# Altium schematic sheet BE2022L-V10.SchDoc
size A4
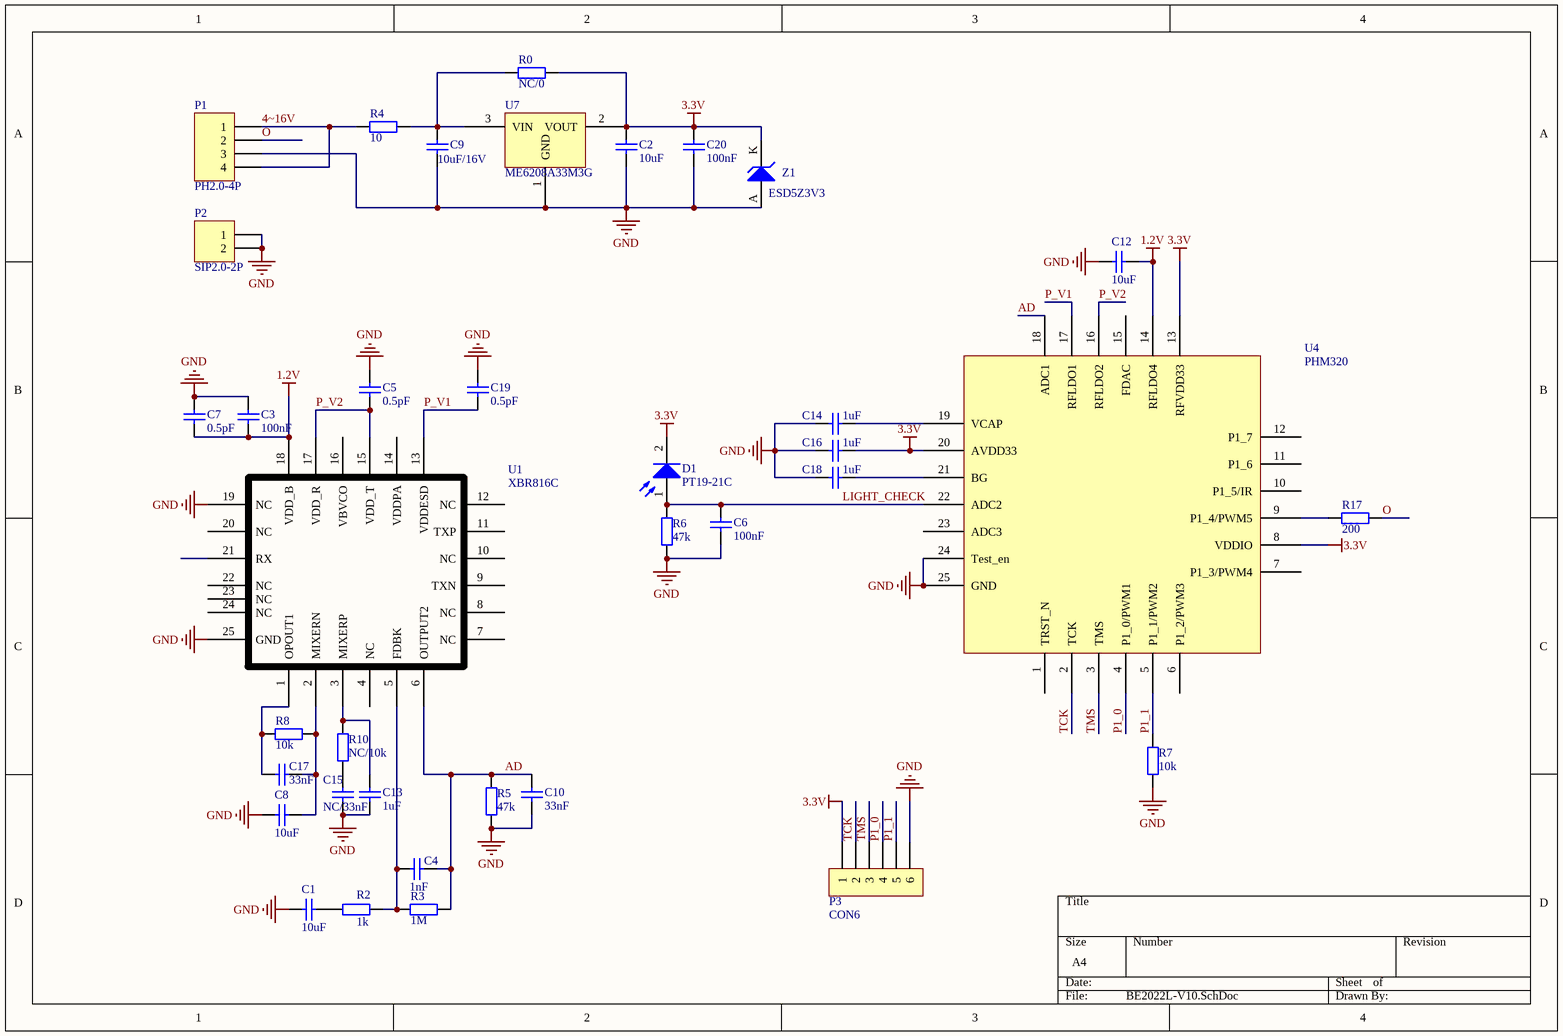
[diagram p0: BE2022L-V10.SchDoc]

## Parts
C1  10uF  [C0402]
C2  10uF  [C0402]
C3  100nF  [C0402]
C4  1nF  [C0402]
C5  0.5pF  [C0402]
C6  100nF  [C0402]
C7  0.5pF  [C0402]
C8  10uF  [C0402]
C9  10uF/16V  [C0603]
C10  33nF  [C0402]
C12  10uF  [C0402]
C13  1uF  [C0402]
C14  1uF  [C0402]
C15  NC/33nF  [C0402]
C16  1uF  [C0402]
C17  33nF  [C0402]
C18  1uF  [C0402]
C19  0.5pF  [C0402]
C20  100nF  [C0402]
D1  PT19-21C  [LED-0603]
P1  PH2.0-4P  [PH2.0-4P]
P2  SIP2.0-2P  [SIP2.0-2P]
P3  CON6  [CON 6PIN-1-2.0-DIP-P]
R0  NC/0  [R0402]
R2  1k  [R0402]
R3  1M  [R0402]
R4  10  [R0402]
R5  47k  [R0402]
R6  47k  [R0402]
R7  10k  [R0402]
R8  10k  [R0402]
R10  NC/10k  [R0402]
R17  200  [R0402]
U1  XBR816C  [QFN24-1]
U4  PHM320  [QFN24]
U7  ME6208A33M3G  [SOT-23-L]
Z1  ESD5Z3V3  [SOD-523]

## Nets
1.2V: C3.2 C7.1 C12.1 U1.18(VDD_B) U4.14(RFLDO4)
3.3V: C2.1 C16.1 C20.2 D1.2(K) P3.1 R0.2 U4.8(VDDIO) U4.13(RFVDD33) U4.20(AVDD33) U7.2(VOUT) Z1.K
GND: C1.2 C2.2 C3.1 C5.2 C6.2 C7.2 C8.1 C9.2 C10.2 C12.2 C13.1 C14.2 C15.1 C16.2 C18.2 C19.2 C20.1 P1.3 P2.1 P2.2 P3.6 R5.2 R6.2 R7.2 U1.19(NC) U1.25(GND) U4.24(Test_en) U4.25(GND) U7.1(GND) Z1.A
4~16V: P1.1 P1.4 R4.1
AD: C4.1 C10.1 R3.1 R5.1 U1.6(OUTPUT2) U4.18(ADC1)
LIGHT_CHECK: C6.1 D1.1(A) R6.1 U4.22(ADC2)
O: P1.2 R17.2
P1_0: P3.4 U4.4(P1_0/PWM1)
P1_1: P3.5 R7.1 U4.5(P1_1/PWM2)
P_V1: C19.1 U1.13(VDDESD) U4.17(RFLDO1)
P_V2: C5.1 U1.15(VDD_T) U1.17(VDD_R) U4.16(RFLDO2)
TCK: P3.2 U4.2(TCK)
TMS: P3.3 U4.3(TMS)
NetC1_1: C1.1 R2.1
NetC4_2: C4.2 R2.2 R3.2 U1.5(FDBK)
NetC8_2: C8.2 C17.1 R8.1 U1.2(MIXERN)
NetC9_1: C9.1 R0.1 R4.2 U7.3(VIN)
NetC13_2: C13.2 R10.1 U1.3(MIXERP)
NetC14_1: C14.1 U4.19(VCAP)
NetC15_2: C15.2 R10.2
NetC17_2: C17.2 R8.2 U1.1(OPOUT1)
NetC18_1: C18.1 U4.21(BG)
NetR17_1: R17.1 U4.9(P1_4/PWM5)

Not connected (* = marked no-connect by the designer): U1 4(NC) 7(NC) 8(NC) 9(TXN) 10(NC) 11(TXP) 12(NC) 14(VDDPA) 16(VBVCO) 20(NC) 21(RX) 22(NC) 23(NC) 24(NC); U4 1(TRST_N) 6(P1_2/PWM3) 7(P1_3/PWM4) 10(P1_5/IR) 11(P1_6) 12(P1_7) 15(FDAC) 23(ADC3)

## Library data of the parts
C1-C10 C12-C20 = Cap: Capacitor; Published: 8-Jun-2000; LatestRevisionDate: 17-Jul-2002; LatestRevisionNote: Re-released for DXP Platform.; PackageReference: RAD-0.3; Publisher: Altium Limited; PackageDescription: Radial Cap, Thru-Hole; 2 Leads; 0.3 in Pin Spacing
  C1 C2 C8 C12: Value: 10uF
  C3 C6 C20: Value: 100nF
  C4: Value: 1nF
  C5 C7 C19: Value: 0.5pF
  C9: Value: 10uF/16V
  C10 C17: Value: 33nF
  C13 C14 C16 C18: Value: 1uF
  C15: Value: NC/33nF
D1 = Photo Sen: Photosensitive Diode; Published: 24-Mar-1999; LatestRevisionDate: 17-Jul-2002; LatestRevisionNote: Re-released for DXP Platform.; PackageReference: PIN2; Publisher: Altium Limited; Value: PT19-21C
P1 = Header 4: Header, 4-Pin; LatestRevisionDate: 17-Jul-2002; LatestRevisionNote: Re-released for DXP Platform.; Publisher: Altium Limited
P2 = Header 2: Header, 2-Pin; LatestRevisionDate: 17-Jul-2002; LatestRevisionNote: Re-released for DXP Platform.; Publisher: Altium Limited
P3 = CON6: Connector
R0 R2-R8 R10 R17 = Res2: Resistor; Published: 8-Jun-2000; LatestRevisionDate: 17-Jul-2002; LatestRevisionNote: Re-released for DXP Platform.; PackageReference: AXIAL-0.4; Publisher: Altium Limited
  R0: Value: NC/0
  R2: PackageDescription: Axial Device, Thru-Hole; 2 Leads; 0.4 in Pin Spacing; Value: 1k
  R3: PackageDescription: Axial Device, Thru-Hole; 2 Leads; 0.4 in Pin Spacing; Value: 1M
  R4: PackageDescription: Axial Device, Thru-Hole; 2 Leads; 0.4 in Pin Spacing; Value: 10
  R5 R6: PackageDescription: Axial Device, Thru-Hole; 2 Leads; 0.4 in Pin Spacing; Value: 47k
  R7 R8: PackageDescription: Axial Device, Thru-Hole; 2 Leads; 0.4 in Pin Spacing; Value: 10k
  R10: PackageDescription: Axial Device, Thru-Hole; 2 Leads; 0.4 in Pin Spacing; Value: NC/10k
  R17: Value: 200
U1 = XBR1000_24_1
U7 = SSP6206
Z1 = D Zener: Zener Diode; Published: 8-Jun-2000; LatestRevisionDate: 17-Jul-2002; LatestRevisionNote: Re-released for DXP Platform.; PackageReference: DIODE-0.7; Publisher: Altium Limited; PackageDescription: Diode, Thru-Hole; 2 Leads; 0.7 in Pin Spacing